# EAGLE design Dash Switches (EAGLE 7.4.0)
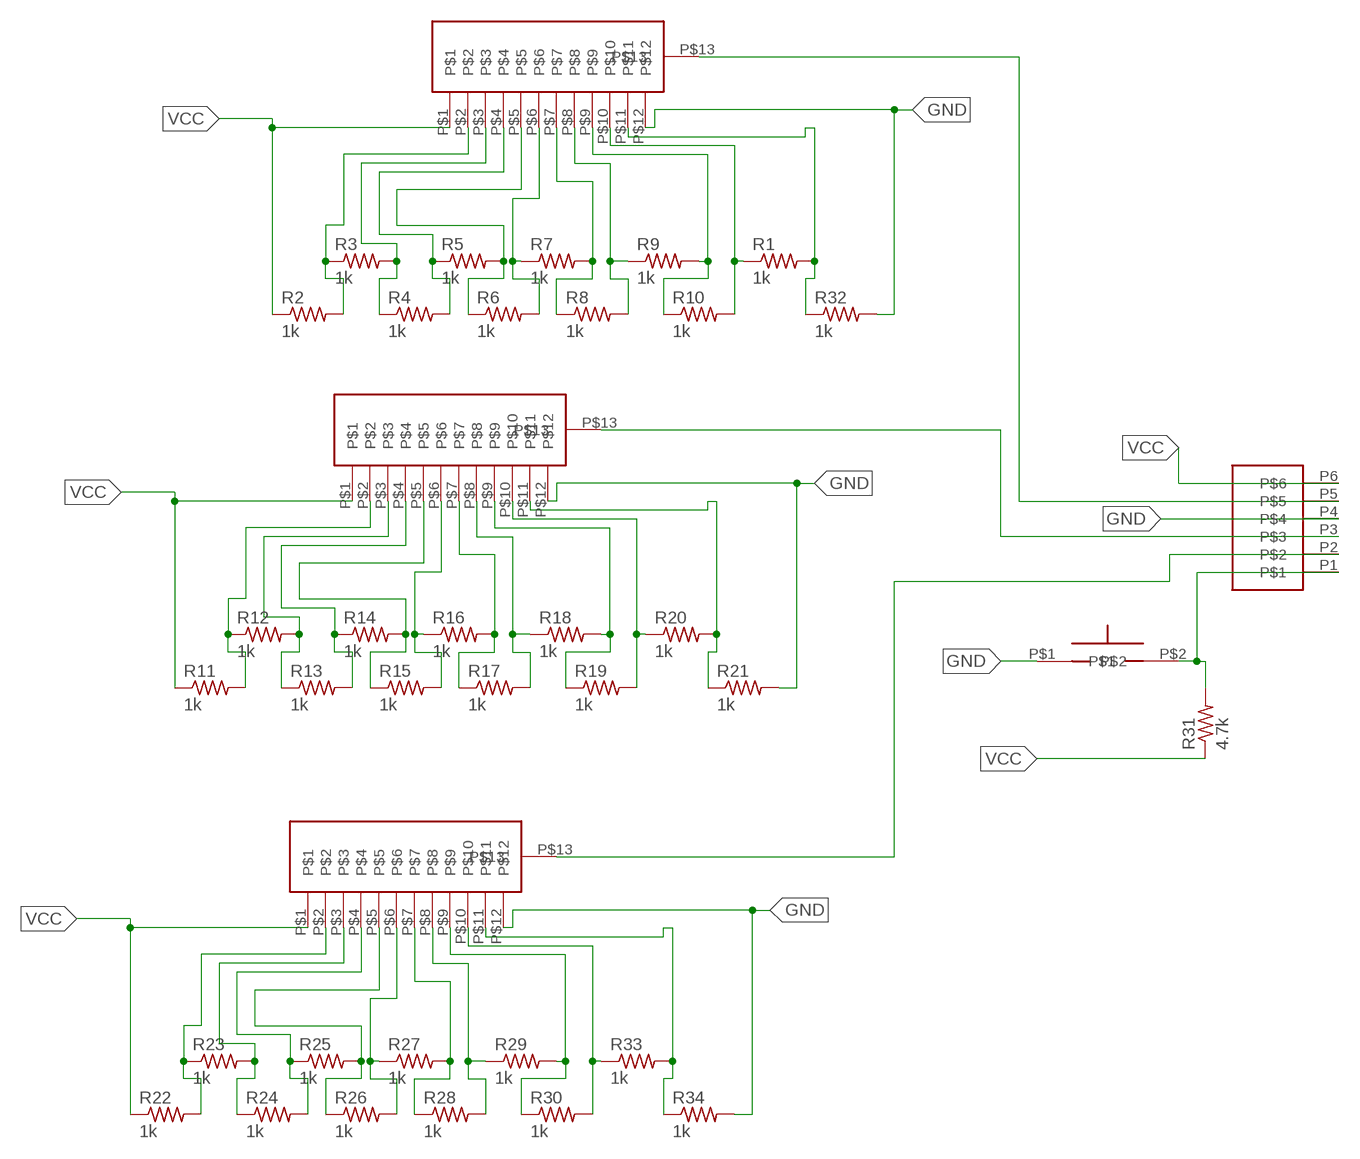
[diagram p0: schematic, sheet 1]

## Parts
R1  1k  R-US_R0603  [R0603]
R2  1k  R-US_R0603  [R0603]
R3  1k  R-US_R0603  [R0603]
R4  1k  R-US_R0603  [R0603]
R5  1k  R-US_R0603  [R0603]
R6  1k  R-US_R0603  [R0603]
R7  1k  R-US_R0603  [R0603]
R8  1k  R-US_R0603  [R0603]
R9  1k  R-US_R0603  [R0603]
R10  1k  R-US_R0603  [R0603]
R11  1k  R-US_R0603  [R0603]
R12  1k  R-US_R0603  [R0603]
R13  1k  R-US_R0603  [R0603]
R14  1k  R-US_R0603  [R0603]
R15  1k  R-US_R0603  [R0603]
R16  1k  R-US_R0603  [R0603]
R17  1k  R-US_R0603  [R0603]
R18  1k  R-US_R0603  [R0603]
R19  1k  R-US_R0603  [R0603]
R20  1k  R-US_R0603  [R0603]
R21  1k  R-US_R0603  [R0603]
R22  1k  R-US_R0603  [R0603]
R23  1k  R-US_R0603  [R0603]
R24  1k  R-US_R0603  [R0603]
R25  1k  R-US_R0603  [R0603]
R26  1k  R-US_R0603  [R0603]
R27  1k  R-US_R0603  [R0603]
R28  1k  R-US_R0603  [R0603]
R29  1k  R-US_R0603  [R0603]
R30  1k  R-US_R0603  [R0603]
R31  4.7k  R-US_R0603  [R0603]
R32  1k  R-US_R0603  [R0603]
R33  1k  R-US_R0603  [R0603]
R34  1k  R-US_R0603  [R0603]
U$1  ROTSWITCH  [ROTSWITCH]
U$2  ROTSWITCH  [ROTSWITCH]
U$3  ROTSWITCH  [ROTSWITCH]
U$5  PUSH  [PUSH]
U$6  MICRO6LOCK  [MICRO6LOCK]

## Nets
GND: R21.2 R32.2 R34.2 U$1.P$12 U$2.P$12 U$3.P$12 U$5.P$1 U$6.P4
N$1: R1.1 R10.2 U$1.P$10
N$2: R2.2 R3.1 U$1.P$2
N$3: R3.2 R4.1 U$1.P$3
N$4: R4.2 R5.1 U$1.P$4
N$5: R5.2 R6.1 U$1.P$5
N$6: R11.2 R12.1 U$2.P$2
N$7: R12.2 R13.1 U$2.P$3
N$8: R8.2 R9.1 U$1.P$8
N$9: R9.2 R10.1 U$1.P$9
N$10: R13.2 R14.1 U$2.P$4
N$11: R6.2 R7.1 U$1.P$6
N$12: R7.2 R8.1 U$1.P$7
N$13: R14.2 R15.1 U$2.P$5
N$14: R17.2 R18.1 U$2.P$8
N$15: R18.2 R19.1 U$2.P$9
N$16: R15.2 R16.1 U$2.P$6
N$17: R16.2 R17.1 U$2.P$7
N$18: R19.2 R20.1 U$2.P$10
N$19: U$2.P$13 U$6.P3
N$20: R20.2 R21.1 U$2.P$11
N$21: R22.2 R23.1 U$3.P$2
N$22: R23.2 R24.1 U$3.P$3
N$23: R24.2 R25.1 U$3.P$4
N$24: R25.2 R26.1 U$3.P$5
N$25: R28.2 R29.1 U$3.P$8
N$26: R29.2 R30.1 U$3.P$9
N$27: R26.2 R27.1 U$3.P$6
N$28: R27.2 R28.1 U$3.P$7
N$29: R30.2 R33.1 U$3.P$10
N$30: U$3.P$13 U$6.P2
N$31: R33.2 R34.1 U$3.P$11
N$37: U$1.P$13 U$6.P5
N$40: R31.2 U$5.P$2 U$6.P1
N$1000: R1.2 R32.1 U$1.P$11
VCC: R2.1 R11.1 R22.1 R31.1 U$1.P$1 U$2.P$1 U$3.P$1 U$6.P6

## Library data of the parts
R1-R34 = rcl:R-US_: RESISTOR, American symbol
U$1-U$3 = DashAndCAN library:ROTSWITCH
U$5 = DashAndCAN library:PUSH
U$6 = DashAndCAN library:MICRO6LOCK

## Board
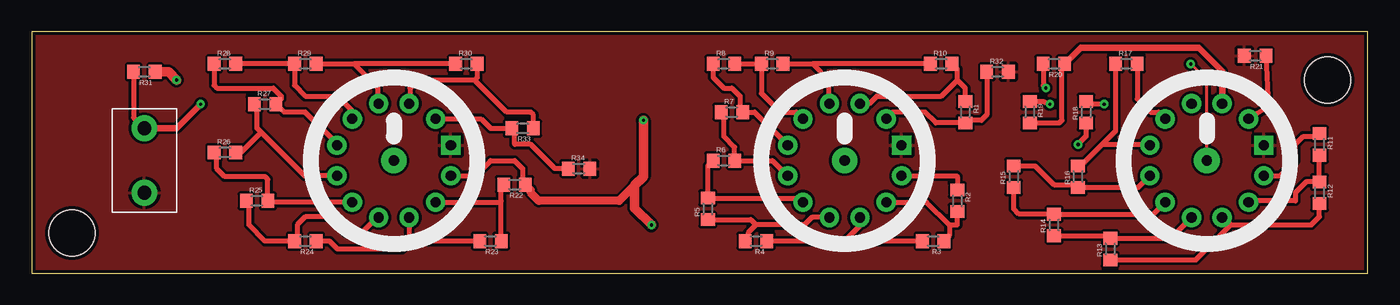
[diagram p1: board, top side]
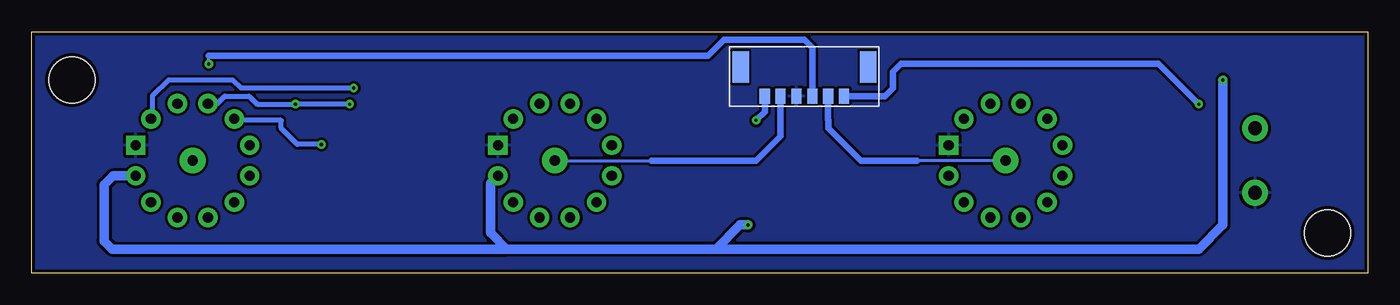
[diagram p2: board, bottom side, seen from below]

Size 105.41 x 19.05 mm. Coordinates in mm from the lower left corner, seen from the top.
Outline: 0,0 105.41,0 105.41,19.05 0,19.05 0,0
Copper layers (1*16): Top 0.035mm / dielectric 1.5mm / Bottom 0.035mm
Design rules "default *": minimum track width 7mil, minimum drill 10mil, track to track 8mil, track to pad 8mil, pad to pad 8mil, via to via 8mil, smd to smd 8mil, copper to edge 11mil, drill to drill 11mil, minimum pad ring 10mil, minimum via ring 8mil, stop-mask expansion 4mil, vias tented up to drill 0mil, thermal gap 10mil
Holes 3.66 mm at 102.23,15.24 3.17,3.17

### Footprints (pad centres in the part's own frame; a part is rotated, then mirrored left to right if it is on the bottom)
R0603 = smd 1 x 1.1: 1 -0.85,0; 2 0.85,0
ROTSWITCH = drill 0.8 pad 1.524: P$1 4.49,-1.203; P$2 3.287,-3.287; P$3 1.203,-4.491; P$4 -1.203,-4.491; P$5 -3.287,-3.287; P$6 -4.491,-1.203; P$7 -4.49,1.203; P$8 -3.287,3.287; P$9 -1.203,4.49; P$10 1.203,4.49; P$11 3.287,3.287 | drill 0.8 pad 1.524 square: P$12 4.49,1.203 | drill 0.8 pad 2.032: P$13 0,0
PUSH = drill 1.092 pad 2.032: P$1 -2.54,0; P$2 2.54,0
MICRO6LOCK = smd 0.8 x 1.2: P1 3.125,0; P2 1.875,0; P3 0.625,0; P4 -0.625,0; P5 -1.875,0; P6 -3.125,0 | smd 1.3 x 2.5: P$1 -5.025,2.295; P$2 5.025,2.295

### Placement (x,y rotation side)
R1  73.66,12.7 270 top
R2  73.03,5.71 270 top
R3  71.12,2.54 180 top
R4  57.15,2.54 180 top
R5  53.34,5.08 90 top
R6  54.61,8.89 0 top
R7  55.24,12.7 0 top
R8  54.61,16.51 0 top
R9  58.42,16.51 0 top
R10  71.75,16.51 0 top
R11  101.6,10.16 270 top
R12  101.6,6.35 270 top
R13  85.09,1.91 90 top
R14  80.64,3.81 90 top
R15  77.47,7.62 90 top
R16  82.55,7.62 90 top
R17  86.36,16.51 0 top
R18  83.19,12.7 90 top
R19  78.74,12.7 270 top
R20  80.64,16.51 180 top
R21  96.52,17.14 180 top
R22  38.1,6.99 180 top
R23  36.2,2.54 180 top
R24  21.59,2.54 180 top
R25  17.78,5.71 0 top
R26  15.24,9.53 0 top
R27  18.41,13.34 0 top
R28  15.24,16.51 0 top
R29  21.59,16.51 0 top
R30  34.29,16.51 0 top
R31  8.89,15.88 180 top
R32  76.2,15.88 0 top
R33  38.73,11.43 180 top
R34  43.18,8.26 0 top
U$1  64.14,8.89 0 top
U$2  92.71,8.89 0 top
U$3  28.57,8.89 0 top
U$5  8.89,8.89 90 top
U$6  44.45,13.97 0 bottom

### Tracks (layer width: path | path; a pad name or v marks a point on that pad's centre or on a via)
GND
  pour Bottom: 0,19.05 105.41,19.05 105.41,0 0,0
  pour Top: 0,0 0,19.05 105.41,19.05 105.41,0
N$1
  Top 0.406: U$1.P$10 66.08,13.38 66.67,13.97 71.75,13.97 73.03,15.24 | 73.03,15.24 73.03,16.09 R10.2 | R1.1 73.66,14.61 73.03,15.24
N$2
  Top 0.406: U$1.P$2 70.6,5.6 72.39,3.81 | 72.39,3.81 73.03,3.81 R2.2 | 72.39,3.81 72.39,2.96 R3.1
N$3
  Top 0.406: U$1.P$3 65.34,3.74 64.14,2.54 | 64.14,2.54 R4.1 | R3.2 64.14,2.54
N$4
  Top 0.406: U$1.P$4 61.55,4.4 60.96,3.81 57.15,3.81 | 57.15,3.81 56.52,3.17 56.52,2.75 R4.2 | R5.1 56.73,4.23 57.15,3.81
N$5
  Top 0.406: U$1.P$5 60.52,5.93 R5.2 53.34,8.47 R6.1
N$6
  Top 0.406: R11.2 R12.1 100.55,7.2 99.69,6.35 99.69,5.71 96.11,5.71 U$2.P$2
N$7
  Top 0.406: U$2.P$3 94.03,4.4 94.61,3.81 | 94.61,3.81 100.97,3.81 101.6,4.45 R12.2 | R13.1 91.86,1.05 94.61,3.81
N$8
  Top 0.406: R8.2 R9.1 57.57,14.19 59.05,12.7 60.33,12.7 U$1.P$8
N$9
  Top 0.406: R9.2 60.96,16.51 61.59,16.51 | 61.59,16.51 62.87,15.24 62.87,13.45 U$1.P$9 | R10.1 61.59,16.51
N$10
  Top 0.406: U$2.P$4 89.86,2.75 R13.2 84.89,2.96 R14.1
N$11
  Top 0.406: U$1.P$6 58.44,8.89 R6.2 55.46,9.95 54.61,10.79 54.61,12.48 R7.1
N$12
  Top 0.406: U$1.P$7 57.04,12.7 R7.2 55.88,12.91 55.88,13.97 55.24,14.61 54.61,14.61 53.76,15.46 R8.1
N$13
  Top 0.406: U$2.P$5 88.48,4.66 R14.2 77.89,4.66 77.47,5.08 R15.1
N$14  (via drill 0.25 pad 0.25)
  Top 0.406: R17.2 87.21,13.76 88.27,12.7 88.9,12.7 U$2.P$8 | R18.1 83.19,10.79 v82.55,10.16
  Bottom 0.406: v82.55,10.16 84.45,10.16 85.72,11.43 85.72,12.06 89.31,12.06 U$2.P$8
N$15  (via drill 0.25 pad 0.25)
  Top 0.406: v84.61,13.34 83.4,13.34 R18.2 | R19.1 79.8,13.55 v80.33,13.34
  Bottom 0.406: U$2.P$9 90.76,13.38 90.17,13.97 88.27,13.97 87.63,13.34 v84.61,13.34 v80.33,13.34
N$16
  Top 0.406: R15.2 79.16,8.47 80.64,6.99 82.33,6.99 R16.1 87.3,6.77 U$2.P$6
N$17
  Top 0.406: R16.2 82.77,8.47 84.45,10.16 | 84.45,10.16 88.15,10.16 U$2.P$7 | R17.1 85.51,11.21 84.45,10.16
N$18
  Top 0.406: R19.2 81.06,11.85 81.28,12.06 81.28,16.3 R20.1
  Top 0.508: U$2.P$10 93.91,15.94 92.08,17.78 82.77,17.78 R20.1
N$19  (via drill 0.25 pad 0.51)
  Top 0.254: U$2.P$13 92.71,15.24 v91.44,16.51
  Bottom 0.254: v91.44,16.51 91.44,17.14
  Bottom 0.508: 91.44,17.14 52.07,17.14 50.8,18.41 44.45,18.41 43.81,17.78 43.83,17.77 U$6.P3
N$20  (via drill 0.25 pad 0.25)
  Top 0.406: R21.1 97.58,13.12 U$2.P$11 | R20.2 79.8,14.82 v80.01,14.61
  Bottom 0.406: v80.01,14.61 88.9,14.61 89.53,15.24 94.61,15.24 95.89,13.97 95.89,12.29 U$2.P$11
N$21
  Top 0.406: R23.1 37.05,5.71 | 37.05,5.71 37.05,6.78 R22.2 | U$3.P$2 36.93,5.6 37.05,5.71
N$22
  Top 0.406: U$3.P$3 29.78,2.47 | 29.78,2.47 29.21,1.91 24.13,1.91 23.5,2.54 R24.1 | R23.2 29.84,2.54 29.78,2.47
N$23
  Top 0.406: R25.1 17.14,5.5 17.14,3.81 18.41,2.54 R24.2 20.95,2.75 20.95,3.81 21.59,4.45 23.5,4.45 24.77,3.17 26.04,3.17 27.26,4.4 U$3.P$4
N$24
  Top 0.406: U$3.P$5 18.74,5.6 R25.2 18.63,7.41 18.41,7.62 15.24,7.62 14.61,8.26 14.61,9.31 R26.1
N$25
  Top 0.406: U$3.P$8 25.4,12.29 25.4,12.7 24.13,13.97 21.59,13.97 20.74,14.82 R29.1 R28.2
N$26
  Top 0.406: R29.2 25.4,16.51 | 25.4,16.51 27.3,14.61 27.3,13.45 U$3.P$9 | R30.1 25.4,16.51
N$27
  Top 0.406: U$3.P$6 21.52,7.69 18.1,11.11 | 18.1,11.11 17.78,11.43 17.78,13.12 R27.1 | R26.2 16.51,9.53 18.1,11.11
N$28
  Top 0.406: U$3.P$7 24.09,10.21 21.59,12.7 19.9,12.7 R27.2 19.68,13.76 19.68,13.97 19.05,14.61 14.61,14.61 14.39,14.82 R28.1
N$29
  Top 0.406: R30.2 35.14,15.46 34.92,15.24 | 34.92,15.24 30.48,15.24 29.84,14.61 29.84,13.45 U$3.P$10 | R33.1 39.59,12.48 39.37,12.7 37.47,12.7 34.92,15.24
N$30
  Bottom 0.254: U$3.P$13 35.56,8.89
  Bottom 0.508: U$6.P2 42.58,12.1 42.55,12.06 42.55,11.43 40.01,8.89 35.56,8.89
N$31
  Top 0.406: U$3.P$11 35.45,12.18 36.2,11.43 R33.2 38.1,11.21 38.1,10.16 39.37,10.16 41.27,8.26 R34.1 42.55,8.47
N$37
  Bottom 0.254: U$1.P$13 56.52,8.89
  Bottom 0.508: 56.52,8.89 48.26,8.89 46.35,10.79 46.35,13.94 U$6.P5
N$40  (via drill 0.25 pad 0.51)
  Top 0.406: R31.2 8.04,12.28 U$5.P$2
  Top 0.508: v13.34,13.34 11.43,11.43 U$5.P$2
  Bottom 0.508: v13.34,13.34 16.51,16.51 36.83,16.51 37.47,15.88 37.47,14.61 38.1,13.97 U$6.P1
N$1000
  Top 0.406: R32.1 75.35,12.48 74.93,12.06 73.88,12.06 R1.2 71.33,11.85 70.48,12.7 67.94,12.7 U$1.P$11
VCC  (via drill 0.25 pad 0.25, 0.25 pad 0.51)
  Top 0.406: U$3.P$1 34.99,7.69 36.2,8.89 38.1,8.89 38.73,8.26 38.73,7.2 R22.1 | U$1.P$1 72.96,7.69 73.03,7.62 R2.1 | U$2.P$1 98.49,7.69 99.69,8.89 99.69,10.16 100.33,10.79 101.39,10.79 R11.1
  Top 0.635: 47.58,6.93 46.35,5.71 40.01,5.71 39.37,6.35 39.37,6.57 R22.1
  Top 0.762: v48.9,3.81 47.58,5.13 47.58,6.93 48.26,7.62 v48.26,12.06 | R31.1 10.79,15.88 v11.43,15.24
  Bottom 0.508: U$6.P6 47.58,12.75 v48.26,12.06
  Bottom 0.762: v48.9,3.81 49.53,3.81 51.44,1.91 | 51.44,1.91 67.94,1.91 | 67.94,1.91 69.22,3.17 69.22,7.1 U$1.P$1 | U$2.P$1 98.99,7.69 99.69,6.99 99.69,2.54 99.06,1.91 67.94,1.91 | v11.43,15.24 11.43,3.81 13.34,1.91 51.44,1.91